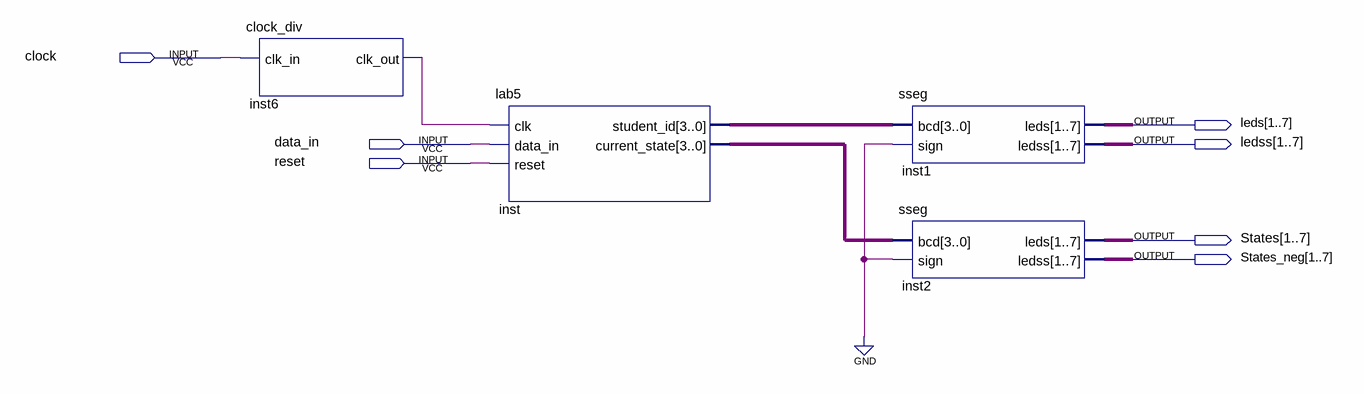
[diagram p0: schematic sheet]
// Quartus schematic FSMBlock.bdf as structural Verilog: 4 symbols, 7 pins
module FSMBlock (
  input  clock,
  input  data_in,
  input  reset,
  output [1:7] leds,
  output [1:7] ledss,
  output [1:7] States,
  output [1:7] States_neg
);

  wire inst6_clk_out;
  wire [3:0] inst_current_state, inst_student_id;

  clock_div inst6 (.clk_in(clock), .clk_out(inst6_clk_out));
  lab5 inst (
    .clk(inst6_clk_out), .data_in(data_in), .reset(reset), .student_id(inst_student_id),
    .current_state(inst_current_state));
  sseg inst1 (.bcd(inst_student_id), .sign(1'b0), .leds(leds), .ledss(ledss));
  sseg inst2 (.bcd(inst_current_state), .sign(1'b0), .leds(States), .ledss(States_neg));
endmodule
